# Altium project Transmitter.PrjPcb
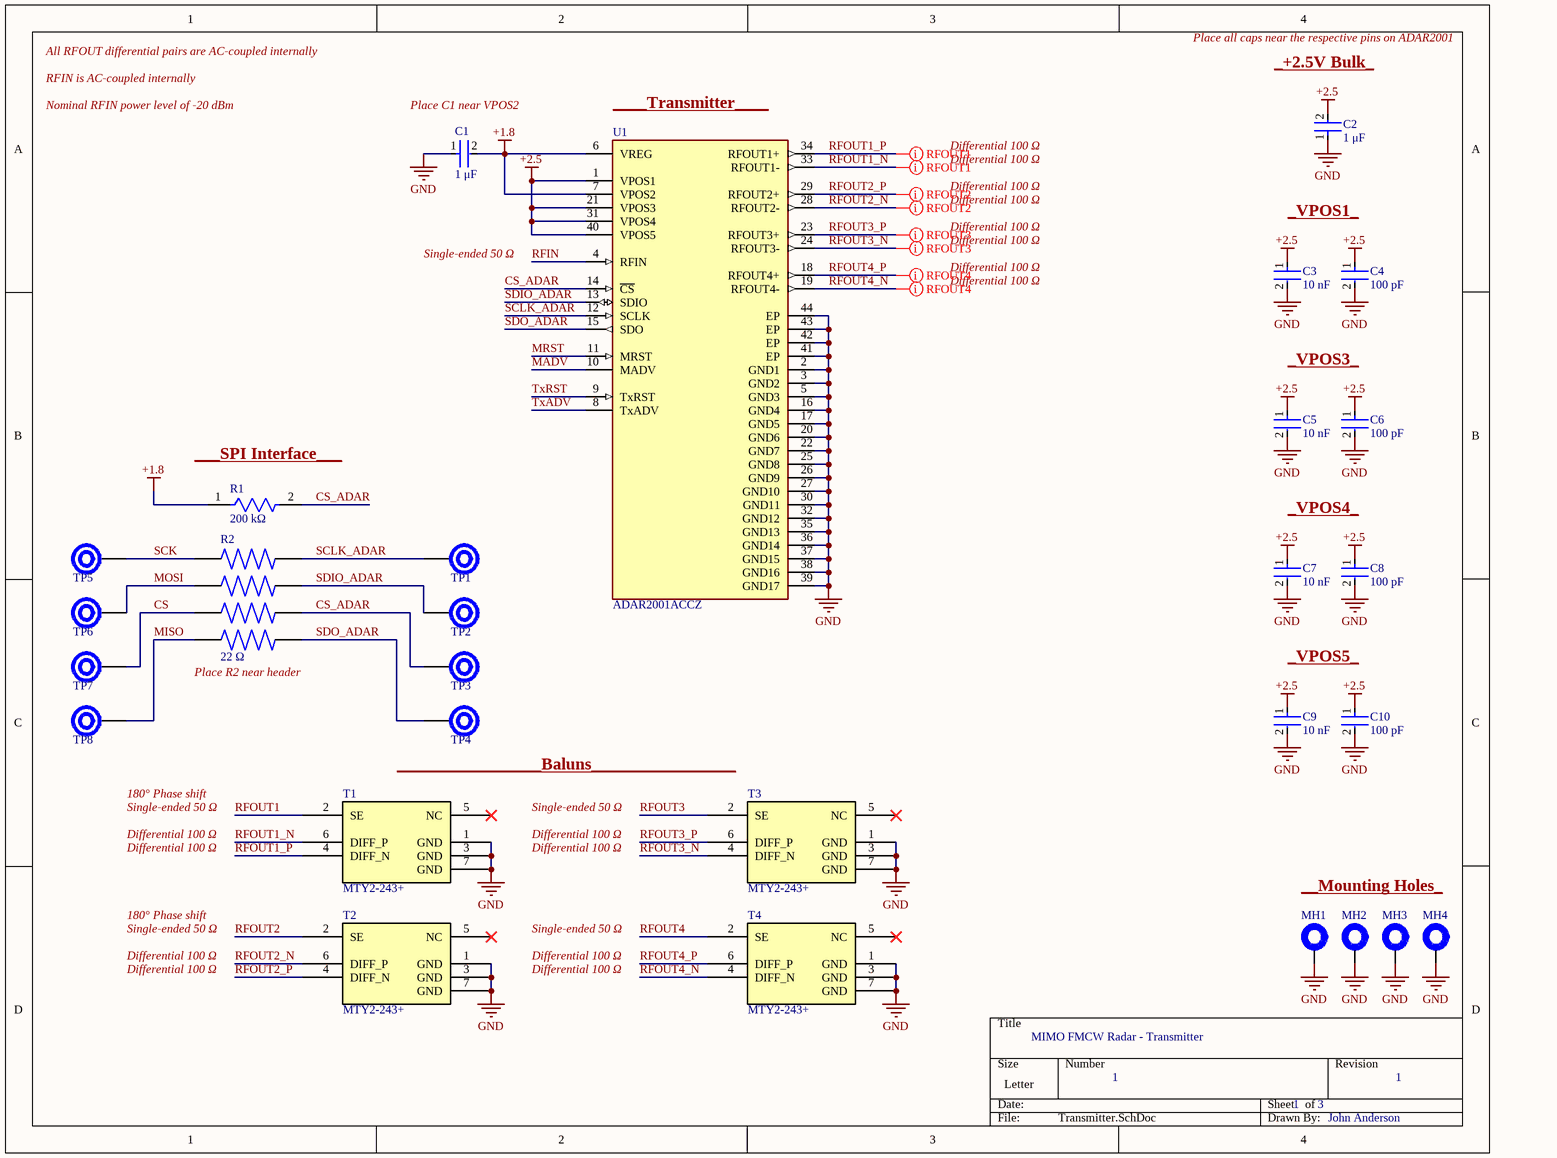
[diagram p0: Transmitter.SchDoc]
3 sheets, 75 parts. Net scope: global (net labels, ports and power ports of the same name join across sheets).
Board file: PCB.PcbDoc
Sheets:
  Transmitter.SchDoc
  Interface.SchDoc
  Power.SchDoc

## Sheet Transmitter.SchDoc
size Letter

### Parts
C1  1 μF  [FP-0603-L_1_6_0_15-W_0_8-MFG]
C2  1 μF  [FP-0603-L_1_6_0_15-W_0_8-MFG]
C3  10 nF  [CGA3E2X7R1H103K080AA-Footprint-1]
C4  100 pF  [FP-C0603C-CF-IPC_C]
C5  10 nF  [CGA3E2X7R1H103K080AA-Footprint-1]
C6  100 pF  [FP-C0603C-CF-IPC_C]
C7  10 nF  [CGA3E2X7R1H103K080AA-Footprint-1]
C8  100 pF  [FP-C0603C-CF-IPC_C]
C9  10 nF  [CGA3E2X7R1H103K080AA-Footprint-1]
C10  100 pF  [FP-C0603C-CF-IPC_C]
MH1  M3 Plated Mounting Hole - Loose  [M3 Plated Mounting Hole-Footprint-1]  (value not drawn)
MH2  M3 Plated Mounting Hole - Loose  [M3 Plated Mounting Hole-Footprint-1]  (value not drawn)
MH3  M3 Plated Mounting Hole - Loose  [M3 Plated Mounting Hole-Footprint-1]  (value not drawn)
MH4  M3 Plated Mounting Hole - Loose  [M3 Plated Mounting Hole-Footprint-1]  (value not drawn)
R1  200 kΩ  [FP-RG1608-IPC_C]
R2  22 Ω  [CAY16-22R0F4LF-Footprint-1]
T1  MTY2-243+  [MTY2-243+-Footprint-1]
T2  MTY2-243+  [MTY2-243+-Footprint-1]
T3  MTY2-243+  [MTY2-243+-Footprint-1]
T4  MTY2-243+  [MTY2-243+-Footprint-1]
TP1  Test Point - 32 mil  [Test Point - 32 mil-Footprint-1]  (value not drawn)
TP2  Test Point - 32 mil  [Test Point - 32 mil-Footprint-1]  (value not drawn)
TP3  Test Point - 32 mil  [Test Point - 32 mil-Footprint-1]  (value not drawn)
TP4  Test Point - 32 mil  [Test Point - 32 mil-Footprint-1]  (value not drawn)
TP5  Test Point - 32 mil  [Test Point - 32 mil-Footprint-1]  (value not drawn)
TP6  Test Point - 32 mil  [Test Point - 32 mil-Footprint-1]  (value not drawn)
TP7  Test Point - 32 mil  [Test Point - 32 mil-Footprint-1]  (value not drawn)
TP8  Test Point - 32 mil  [Test Point - 32 mil-Footprint-1]  (value not drawn)
U1  ADAR2001ACCZ  [FP-CC-40-7-MFG]

### Nets
+1.8: C1.2 R1.1 U1.6(VREG) U1.7(VPOS2)
+2.5: C2.2 C3.1 C4.1 C5.1 C6.1 C7.1 C8.1 C9.1 C10.1 U1.1(VPOS1) U1.21(VPOS3) U1.31(VPOS4) U1.40(VPOS5)
GND: C1.1 C2.1 C3.2 C4.2 C5.2 C6.2 C7.2 C8.2 C9.2 C10.2 MH1.1 MH2.1 MH3.1 MH4.1 T1.1(GND) T1.3(GND) T1.7(GND) T2.1(GND) T2.3(GND) T2.7(GND) T3.1(GND) T3.3(GND) T3.7(GND) T4.1(GND) T4.3(GND) T4.7(GND) U1.2(GND1) U1.3(GND2) U1.5(GND3) U1.16(GND4) U1.17(GND5) U1.20(GND6) U1.22(GND7) U1.25(GND8) U1.26(GND9) U1.27(GND10) U1.30(GND11) U1.32(GND12) U1.35(GND13) U1.36(GND14) U1.37(GND15) U1.38(GND16) U1.39(GND17) U1.41(EP) U1.42(EP) U1.43(EP) U1.44(EP)
CS: R2.3 TP7.1
CS_ADAR: R1.2 R2.6 TP3.1 U1.14(~{CS})
MADV: U1.10(MADV)
MISO: R2.4 TP8.1
MOSI: R2.2 TP6.1
MRST: U1.11(MRST)
RFIN: U1.4(RFIN)
RFOUT1: T1.2(SE)
RFOUT1_N: T1.6(DIFF_P) U1.33(RFOUT1-)
RFOUT1_P: T1.4(DIFF_N) U1.34(RFOUT1+)
RFOUT2: T2.2(SE)
RFOUT2_N: T2.6(DIFF_P) U1.28(RFOUT2-)
RFOUT2_P: T2.4(DIFF_N) U1.29(RFOUT2+)
RFOUT3: T3.2(SE)
RFOUT3_N: T3.4(DIFF_N) U1.24(RFOUT3-)
RFOUT3_P: T3.6(DIFF_P) U1.23(RFOUT3+)
RFOUT4: T4.2(SE)
RFOUT4_N: T4.4(DIFF_N) U1.19(RFOUT4-)
RFOUT4_P: T4.6(DIFF_P) U1.18(RFOUT4+)
SCK: R2.1 TP5.1
SCLK_ADAR: R2.8 TP1.1 U1.12(SCLK)
SDIO_ADAR: R2.7 TP2.1 U1.13(SDIO)
SDO_ADAR: R2.5 TP4.1 U1.15(SDO)
TxADV: U1.8(TxADV)
TxRST: U1.9(TxRST)

Not connected (* = marked no-connect by the designer): T1 5(NC)*; T2 5(NC)*; T3 5(NC)*; T4 5(NC)*

### Layout directives
differential pair: RFOUT1_N, RFOUT1_P, RFOUT2_N, RFOUT2_P, RFOUT3_N, RFOUT3_P, RFOUT4_N, RFOUT4_P

### Notes on the sheet
- All RFOUT differential pairs are AC-coupled internally
- RFIN is AC-coupled internally
- Place all caps near the respective pins on ADAR2001
- (near C2) _+2.5V Bulk_
- Nominal RFIN power level of -20 dBm
- (near C1) Place C1 near VPOS2
- (near U1) ____Transmitter____
- Differential 100 Ω
- _VPOS1_
- Single-ended 50 Ω
- _VPOS3_
- (near R1) ___SPI Interface___
- _VPOS4_
- (near R2) Place R2 near header
- _VPOS5_
- _________________Baluns_________________
- 180° Phase shift
- __Mounting Holes_
- MIMO FMCW Radar - Transmitter
- 1
- 3
- John Anderson

### Library data of the parts
C1 C2 = CMP-00100-1: Ceramic Capacitor, Multilayer, Ceramic, 50V, 10% +Tol, 10% -Tol, X7R, 15% TC, 1uF, Surface Mount, 0603; Multilayer: Yes; Packaging: Tape and Reel; Dielectric Material: Ceramic; Terminal Finish: Tin; Min Operating Temperature: -55°C; Mounting Technology: Surface Mount; Pins: 2; Rated DC Voltage (URdc): 50V; Tolerance (fill in as +-): 10%; Package Style: SMTMeter; Length: 1.6mm; RoHS Compliant: Yes; Temperature Characteristics Code: X7R; Value: 1uF; Tolerance  (fill in as +-): 10%; Max Operating Temperature: 125°C; JESD-609 Code: e3; Package Shape: Rectangular; Termination: Wraparound; Reach SVHC Compliant: Yes; Case/Package: 0603; Width: 0.8mm; Capacitor Type: Ceramic; Height: 0.8mm
C3 C5 C7 C9 = CMP-00157-1: CGA Series 0603 10 nF 50 V ±10 % Tolerance X7R SMT Multilayer Ceramic Capacitor; Manufacturer Lifecycle Status: PRODUCTION; Voltage Rating: 50V; Value: 10nF; Tolerance: 10%; Weight: 2.012816mg; Min Width: 700µm; Lead Free: Lead Free; Voltage Rating (DC): 50V; Max Length: 1.7mm; Width: 800µm; Schedule B: 8532240020, 8532240020; Thickness: 889µm; China RoHS: Compliant; Height: 800µm; Material: Ceramic; REACH SVHC: Yes; RoHS: Compliant; Dielectric: X7R; Length: 1.6mm; Ratings: AEC-Q200; Mounting Technology: Surface Mount; Composition: Ceramic; Case/Package: 0603; Termination: SMD/SMT; Dielectric Material: Ceramic; Lifecycle Status: Production; Min Operating Temperature: -55°C; Max Operating Temperature: 125°C; Number of Terminals: 2; Case Code (Metric): 1608; Case Code (Imperial): 0603; Max Width: 900µm; Min Length: 1.5mm
C4 C6 C8 C10 = CMP-00365-1: Multilayer Ceramic Capacitors MLCC – SMD/SMT; KEMET; C0603C101J5GACTU; 100 pF; 0603; 50 V; 50 V; Voltage: 50V; Tolerance: 5%; Dielectric: C0G; Temperature Coefficient: 30ppm/°C; Dissipation Factor: 0.1%; Value: 100pF; Contact Material: Tin; Schedule B: 8532240020, 8532240020; Termination: SMD/SMT; Packaging: Cut Tape; Country of Origin: Mainland China, Mexico; RoHS: Compliant; Height: 800µm; Voltage Rating (AC): 50V; Material: Ceramic; Lifecycle Status: Production; Number of Terminals: 2; Voltage Rating: 50V; Case/Package: 0603; Mounting Technology: Surface Mount; Length: 1.6mm; Min Operating Temperature: -55°C; Width: 800µm; Introduction Date: 1997-02-01; Lead Pitch: 700µm; China RoHS: Compliant; Depth: 800µm; Harmonized Tariff Schedule (HTS) Code: 8532.24.00.20; REACH SVHC: Yes; Dielectric Material: Ceramic; Lead Free: Lead Free; Case Code (Imperial): 0603; Radiation Hardening: No; Voltage Rating (DC): 50V; Export Control Classification Number (ECCN) Code: EAR99; Max Operating Temperature: 125°C; Thickness: 863.6µm; Pins: 2
MH1-MH4 = CMP-00204-1: Plated M3 mounting hole with loose tolerance. 3.6 mm hole diameter, 4.6 mm plated diameter.
R1 = CMP-00366-1: Res Thin Film 0603 200K Ohm 0.1% 0.1W(1/10W) ±25ppm/C Sulfur Resistant Pad SMD Automotive T/R; Voltage Rating (DC): 75V; Working Voltage: 100V; Temperature Coefficient: 25ppm/°C; Max Power Dissipation: 100mW; Value: 200kΩ; Number of Terminals: 2; Height: 400µm; Composition: Thin Film; RoHS: Compliant; Number of Terminations: 2; Lifecycle Status: Production; REACH SVHC: Yes; Termination: SMD/SMT; Tolerance: 0.1%; Weight: 2.012816mg; Case Code (Metric): 1608; Power Dissipation: 100mW; Max Operating Temperature: 155°C; Voltage Rating: 100V; Export Control Classification Number (ECCN) Code: EAR99; Min Operating Temperature: -55°C; Harmonized Tariff Schedule (HTS) Code: 8533.21.00.30; Mounting Technology: Surface Mount; Lead Free: Lead Free; Case Code (Imperial): 0603; Schedule B: 8533210045; Length: 1.6mm; Width: 800µm; Power Rating: 100mW; Introduction Date: 2006-03-30; Features: Automotive AEC-Q200; Case/Package: 0603; Country of Origin: Mainland China, Japan
R2 = CMP-00370-1: Res Thick Film Array 22 Ohm 1% 0.25W(1/4W) ±200ppm/C ISOL 8-Pin 1206(4 X 0603) Convex SMD T/R; Temperature Coefficient: 200ppm/°C; Power Per Element: 62.5mW; Number of Elements: 1; Power Dissipation: 250mW; Number of Resistors: 4; Voltage Rating (DC): 50V; Value: 22Ω; Circuit Type: Isolated; REACH SVHC: Yes; Depth: 1.6mm; Case/Package: 1206; Case Code (Imperial): 1206; Lead Pitch: 800µm; Width: 1.6mm; China RoHS: Non-Compliant; Pins: 8; Introduction Date: 2003-04-07; Case Code (Metric): 3216; Schedule B: 8533210025, 8533210025; Mounting Technology: Surface Mount; Termination: Convex; Export Control Classification Number (ECCN) Code: EAR99; Min Operating Temperature: -55°C; Military Standard: Not; Tolerance: 1%; Height: 500µm; Number of Circuits: 4; Lifecycle Status: Production; Working Voltage: 50V; RoHS: Compliant; Max Operating Temperature: 125°C; Contact Plating: Tin; Number of Terminals: 8; Length: 3.2mm; Terminal Pitch: 800µm
T1-T4 = CMP-00368-1: RF Transformer, 10000MHz Min, 24000MHz Max; Insertion Loss (dB): 2.2dB; Clock Frequency: 24GHz; Height: 1mm; Max Operating Temperature: 85°C; Mounting Technology: Surface Mount; Export Control Classification Number (ECCN) Code: EAR99; RoHS: Compliant; Width: 2mm; Length: 2mm; Lifecycle Status: Production; Min Operating Temperature: -40°C; Introduction Date: 2019-12-24
TP1-TP8 = CMP-00284-1: 32 mil (0.8 mm) test point.
U1 = CMP-00364-1: Active RF Multipliers x4 10GHz to 40GHz-OUT 40-Pin LGA EP Tray; Manufacturer Lifecycle Status: PRODUCTION; Bandwidth: 7.5GHz; Max Junction Temperature (Tj): 135°C; Clock Frequency: 40GHz; RoHS: Compliant; Lifecycle Status: Production; Height: 780µm; Pins: 40; Max Operating Temperature: 85°C; Min Operating Temperature: -40°C; Schedule B: 8542390000

## Sheet Interface.SchDoc
size Letter
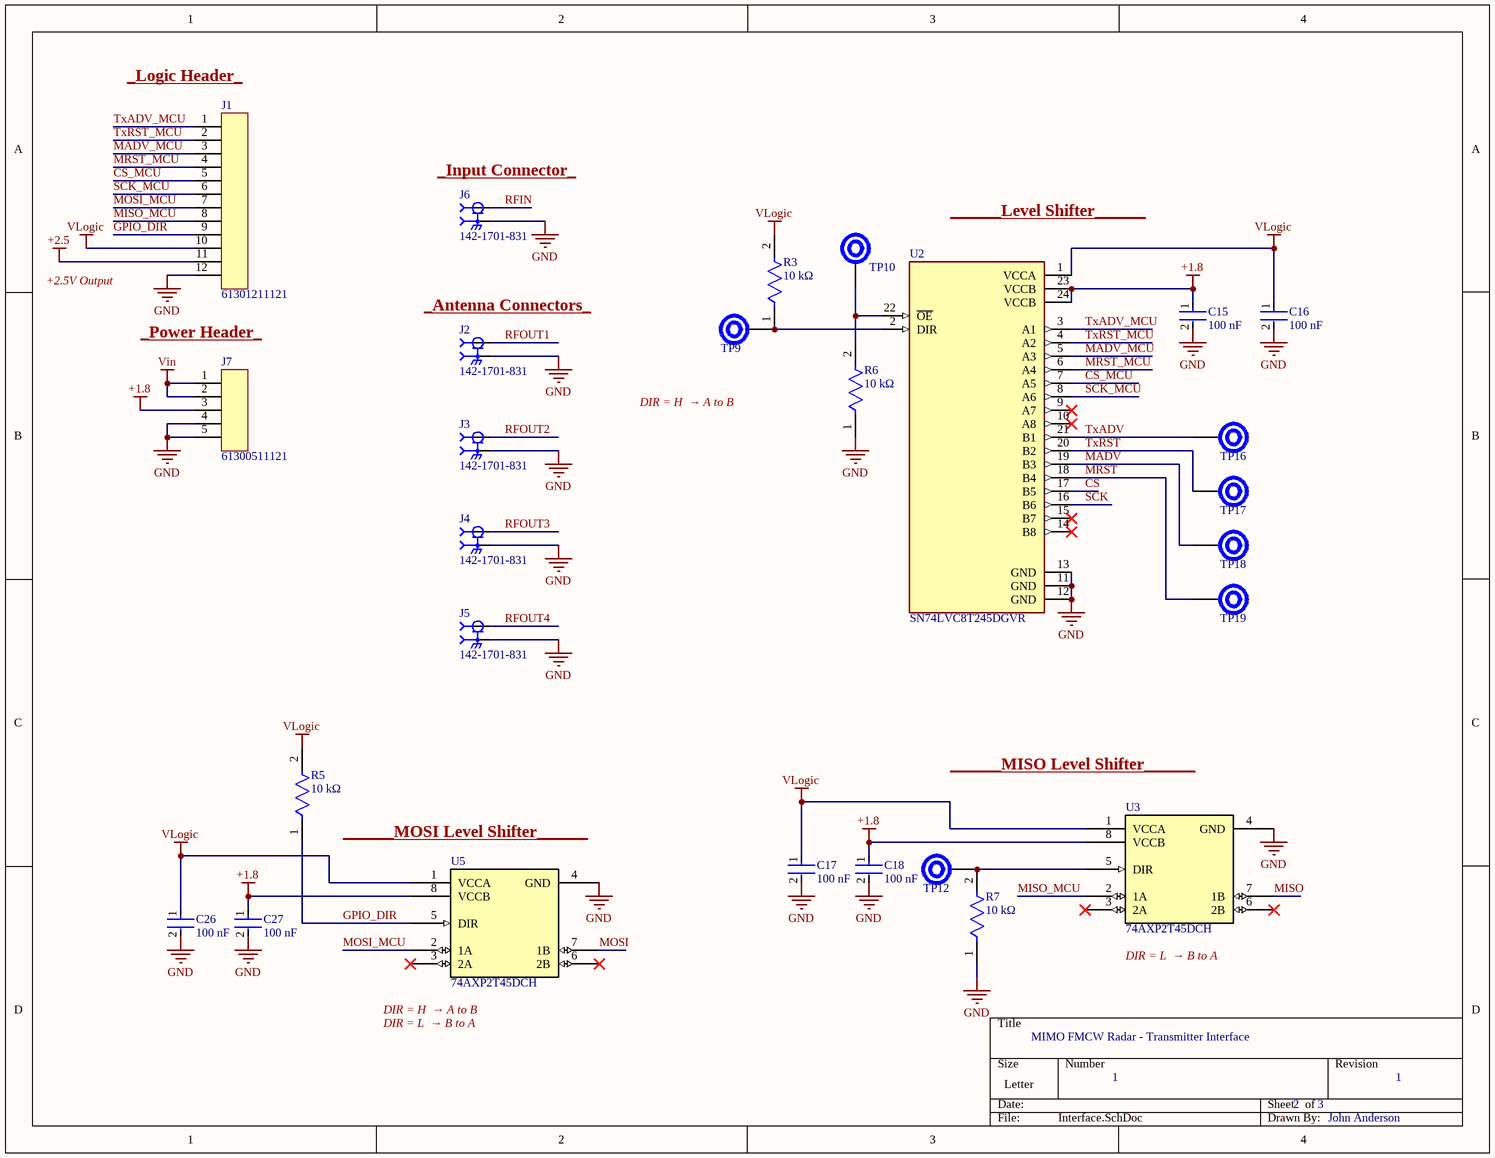
[diagram p1: Interface.SchDoc]

### Parts
C15  100 nF  [FP-CGA3E-0_3-0_1-MFG]
C16  100 nF  [FP-CGA3E-0_3-0_1-MFG]
C17  100 nF  [FP-CGA3E-0_3-0_1-MFG]
C18  100 nF  [FP-CGA3E-0_3-0_1-MFG]
C26  100 nF  [FP-CGA3E-0_3-0_1-MFG]
C27  100 nF  [FP-CGA3E-0_3-0_1-MFG]
J1  61301211121  [61301211121]
J2  142-1701-831  [142-1701-831-Footprint-1]
J3  142-1701-831  [142-1701-831-Footprint-1]
J4  142-1701-831  [142-1701-831-Footprint-1]
J5  142-1701-831  [142-1701-831-Footprint-1]
J6  142-1701-831  [142-1701-831-Footprint-1]
J7  61300511121  [61300511121]
R3  10 kΩ  [FP-RC0603-0_55-IPC_C]
R5  10 kΩ  [FP-RC0603-0_55-IPC_C]
R6  10 kΩ  [FP-RC0603-0_55-IPC_C]
R7  10 kΩ  [FP-RC0603-0_55-IPC_C]
TP9  Test Point - 32 mil  [Test Point - 32 mil-Footprint-1]  (value not drawn)
TP10  Test Point - 32 mil  [Test Point - 32 mil-Footprint-1]  (value not drawn)
TP12  Test Point - 32 mil  [Test Point - 32 mil-Footprint-1]  (value not drawn)
TP16  Test Point - 32 mil  [Test Point - 32 mil-Footprint-1]  (value not drawn)
TP17  Test Point - 32 mil  [Test Point - 32 mil-Footprint-1]  (value not drawn)
TP18  Test Point - 32 mil  [Test Point - 32 mil-Footprint-1]  (value not drawn)
TP19  Test Point - 32 mil  [Test Point - 32 mil-Footprint-1]  (value not drawn)
U2  SN74LVC8T245DGVR  [SN74LVC8T245DGVR-Footprint-1]
U3  74AXP2T45DCH  [74AXP2T45DCH-Footprint-1]
U5  74AXP2T45DCH  [74AXP2T45DCH-Footprint-1]

### Nets
+1.8: C15.1 C18.1 C27.1 J7.3 U2.23(VCCB) U2.24(VCCB) U3.8(VCCB) U5.8(VCCB)
+2.5: J1.11
GND: C15.2 C16.2 C17.2 C18.2 C26.2 C27.2 J1.12 J2.2(GND) J3.2(GND) J4.2(GND) J5.2(GND) J6.2(GND) J7.4 J7.5 R6.1 R7.1 U2.11(GND) U2.12(GND) U2.13(GND) U3.4(GND) U5.4(GND)
Vin: J7.1 J7.2
VLogic: C16.1 C17.1 C26.1 J1.10 R3.2 R5.2 U2.1(VCCA) U3.1(VCCA) U5.1(VCCA)
CS: U2.17(B5)
CS_MCU: J1.5 U2.7(A5)
GPIO_DIR: J1.9 R5.1 U5.5(DIR)
MADV: TP18.1 U2.19(B3)
MADV_MCU: J1.3 U2.5(A3)
MISO: U3.7(1B)
MISO_MCU: J1.8 U3.2(1A)
MOSI: U5.7(1B)
MOSI_MCU: J1.7 U5.2(1A)
MRST: TP19.1 U2.18(B4)
MRST_MCU: J1.4 U2.6(A4)
RFIN: J6.1(SIG)
RFOUT1: J2.1(SIG)
RFOUT2: J3.1(SIG)
RFOUT3: J4.1(SIG)
RFOUT4: J5.1(SIG)
SCK: U2.16(B6)
SCK_MCU: J1.6 U2.8(A6)
TxADV: TP16.1 U2.21(B1)
TxADV_MCU: J1.1 U2.3(A1)
TxRST: TP17.1 U2.20(B2)
TxRST_MCU: J1.2 U2.4(A2)
NetR3_1: R3.1 TP9.1 U2.2(DIR)
NetR6_2: R6.2 TP10.1 U2.22(~{OE})
NetR7_2: R7.2 TP12.1 U3.5(DIR)

Not connected (* = marked no-connect by the designer): U2 9(A7)* 10(A8)* 14(B8)* 15(B7)*; U3 3(2A)* 6(2B)*; U5 3(2A)* 6(2B)*

### Notes on the sheet
- (near J1) _Logic Header_
- (near J6) _Input Connector_
- ______Level Shifter______
- +2.5V Output
- _Power Header_
- (near J2) _Antenna Connectors_
- DIR = H  → A to B
- ______MISO Level Shifter______
- ______MOSI Level Shifter______
- (near U3) DIR = L  → B to A
- DIR = L  → B to A
- (near U5) DIR = H  → A to B
- MIMO FMCW Radar - Transmitter Interface
- 1
- 2
- 3
- John Anderson

### Library data of the parts
C15-C18 C26 C27 = CMP-00054-1: Ceramic Capacitor, Multilayer, Ceramic, 50V, 10% +Tol, 10% -Tol, X7R, 15% TC, 0.1uF, Surface Mount, 0603; Reference Standard: AEC-Q200; Value: 100nF; Multilayer: Yes; Min Operating Temperature: -55°C; Reach SVHC Compliant: Yes; Case/Package: 0603; Width: 0.8mm; Dielectric Material: Ceramic; Pins: 2; JESD-609 Code: e3; Package Style: SMTMeter; Capacitor Type: Ceramic; Mounting Technology: Surface Mount; Tolerance  (fill in as +-): 10%; Max Operating Temperature: 125°C; Packaging: Tape and Reel; Tolerance (fill in as +-): 10%; Terminal Finish: Nickel; Termination: Wraparound; Height: 0.8mm; Temperature Characteristics Code: X7R; Rated DC Voltage (URdc): 50V; Length: 1.6mm; Package Shape: Rectangular; RoHS Compliant: Yes
J1 = CMP-00202-1: THT Vertical Pin Header WR-PHD, Pitch 2.54 mm, Single Row, 12 pins; Number of Positions: 12; Current Rating: 3A; Connector Type: Male Pin; Pitch: 2.54mm; Contact Resistance: 20mΩ; Gender: Male; Operating Supply Voltage: 250V; Color: Black; Contact Plating: Gold; Packaging: Bulk; Mounting Technology: Through Hole; Contact Mating Length: 5.9944mm; Number of Rows: 1; Contact Material: Copper; Number of Contacts: 12; Lead Pitch: 2.54mm; Orientation: Vertical; Pins: 12; Termination: Solder; RoHS: Compliant
J2-J6 = CMP-00382-1: RF SMA Connector, 1 Contact(s), Female, Board Mount, Surface Mount Terminal, Locking, Jack; Polarity: Standard; Insertion Loss (dB): 0.55dB; Insulation Resistance: 1GΩ; Connector Type: SMA, Socket; Body Plating: Gold; Clock Frequency: 26.5GHz; Impedance: 50Ω; Voltage Rating: 170V; Body Material: Brass; Contact Resistance: 4mΩ; Number of Ports: 1; Gender: Male; Dielectric Material: PTFE; Min Operating Temperature: -65°C; Case/Package: SMA; Contact Gender: Female; Shell Material: Brass; RoHS: Compliant; Harmonized Tariff Schedule (HTS) Code: 8536.69.40.10; Introduction Date: 2010-04-24; Orientation: Straight; Lifecycle Status: Production; Contact Material: Copper; Max Operating Temperature: 165°C; Pins: 1; Fastening Type: Threaded; Termination: Solder; Mounting Technology: Edge; Contact Plating: Gold; Export Control Classification Number (ECCN) Code: EAR99; Frequency: 26.5GHz; Housing Color: Gold; REACH SVHC: Yes
J7 = CMP-00200-1: THT Vertical Pin Header WR-PHD, Pitch 2.54 mm, Single Row, 5 pins; Number of Positions: 5; Pitch: 2.54mm; Operating Supply Voltage: 250V; Current Rating: 3A; Contact Resistance: 20mΩ; Gender: Male; Connector Type: Male Pin; Lead Free: Lead Free; Min Operating Temperature: -40°C; Orientation: Vertical; Number of Contacts: 5; Contact Mating Length: 5.9944mm; Pins: 5; Max Operating Temperature: 105°C; Lead Pitch: 2.54mm; RoHS: Compliant; Height: 8.89mm; Voltage Rating: 250V; Mounting Technology: Through Hole; Termination: Solder; Number of Rows: 1; Contact Plating: Gold; Packaging: Bulk; Contact Material: Gold; Color: Black
R3 R5-R7 = CMP-00049-1: Fixed Resistor, Metal Glaze/thick Film, 0.1W, 10000ohm, 75V, 1% +/-Tol, 100ppm/Cel, Surface Mount, 0603; Package Width: 0.8mm; Rated Temperature: 70°C; Temperature Coefficient (ppm/Cel): 100; Package Height: 0.45mm; Power: 100mW; Value: 10kR; Additional Feature: LASER TRIMMABLE; Package Length: 1.6mm; Case/Package: 0603; Termination: Wraparound; Max Operating Temperature: 155°C; Construction: Chip; Mounting Technology: Surface Mount; Packaging: Tape and Reel; RoHS Compliant: Yes; Pins: 2; Working Voltage: 75V; Min Operating Temperature: -55°C; Package Shape: Rectangular; Resistor Type: FIXED RESISTOR; Technology: METAL GLAZE/THICK FILM; Terminal Finish: Nickel; Tolerance: 1%; JESD-609 Code: e3; Reach SVHC Compliant: Yes
TP9 TP10 TP12 TP16-TP19 = CMP-00284-1: 32 mil (0.8 mm) test point.
U2 = CMP-00379-1: IC BUS TRANSCVR 8BIT 24TVSOP / Voltage Level Translator 8-CH Bidirectional 24-Pin TVSOP T/R; Manufacturer Lifecycle Status: ACTIVE; Propagation Delay: 4.2ns; Number of Outputs: 8; Number of Circuits: 1; Topology: Push-Pull; Polarity: Non-Inverting; Data Rate: 500Mbps; Logic Function: Transceiver, Translator; Quiescent Current: 15µA; High Level Output Current: -32mA; Low Level Output Current: 32mA; Operating Supply Voltage: 3.3V; Min Supply Voltage: 1.65V; Turn-On Delay Time: 32.2ns; Max Supply Voltage: 5.5V; Weight: 60.894776mg; Lifecycle Status: Production; Radiation Hardening: No; Length: 5mm; Min Operating Temperature: -40°C; Contact Plating: Gold; Number of Bits: 8; Lead Free: Lead Free; Width: 4.4mm; Termination: SMD/SMT; Height: 1.2mm; Case/Package: TFSOP; Number of Channels: 8; Number of Inputs: 8; Number of Elements: 1; Schedule B: 8542390000; REACH SVHC: No; RoHS: Compliant; Direction: Bidirectional; Packaging: Cut Tape; Number of Transceivers: 8; Pins: 24; Max Operating Temperature: 85°C; Mounting Technology: Surface Mount; Thickness: 1.05mm
U3 U5 = CMP-00336-1: Dual Supply Level Translator 2-bit Bidirectional 0.95V to 5.5V 8-Pin VSSOP; Manufacturer Lifecycle Status: RELEASED FOR SUPPLY; Propagation Delay: 16.5ns; Number of Ports: 2; Operating Supply Voltage: 1.2V; Clock Edge Trigger Type: Positive Edge; Number of Circuits: 1; Low Level Output Current: 12mA; Max Supply Current: 13µA; Load Capacitance: 5pF; Min Supply Voltage: 900mV; Min Operating Temperature: -40°C; Number of Terminals: 8; Number of Bits: 2; Width: 2mm; RoHS: Compliant; Terminal Pitch: 500µm; Introduction Date: 2024-07-25; Number of Channels: 1; Lifecycle Status: Production; China RoHS: Compliant; Max Operating Temperature: 125°C; Max Supply Voltage: 5.5V; Length: 2.3mm; Direction: Bidirectional; Height - Seated (Max): 1mm; Harmonized Tariff Schedule (HTS) Code: 8542.39.00.60; REACH SVHC: Yes

## Sheet Power.SchDoc
size Letter
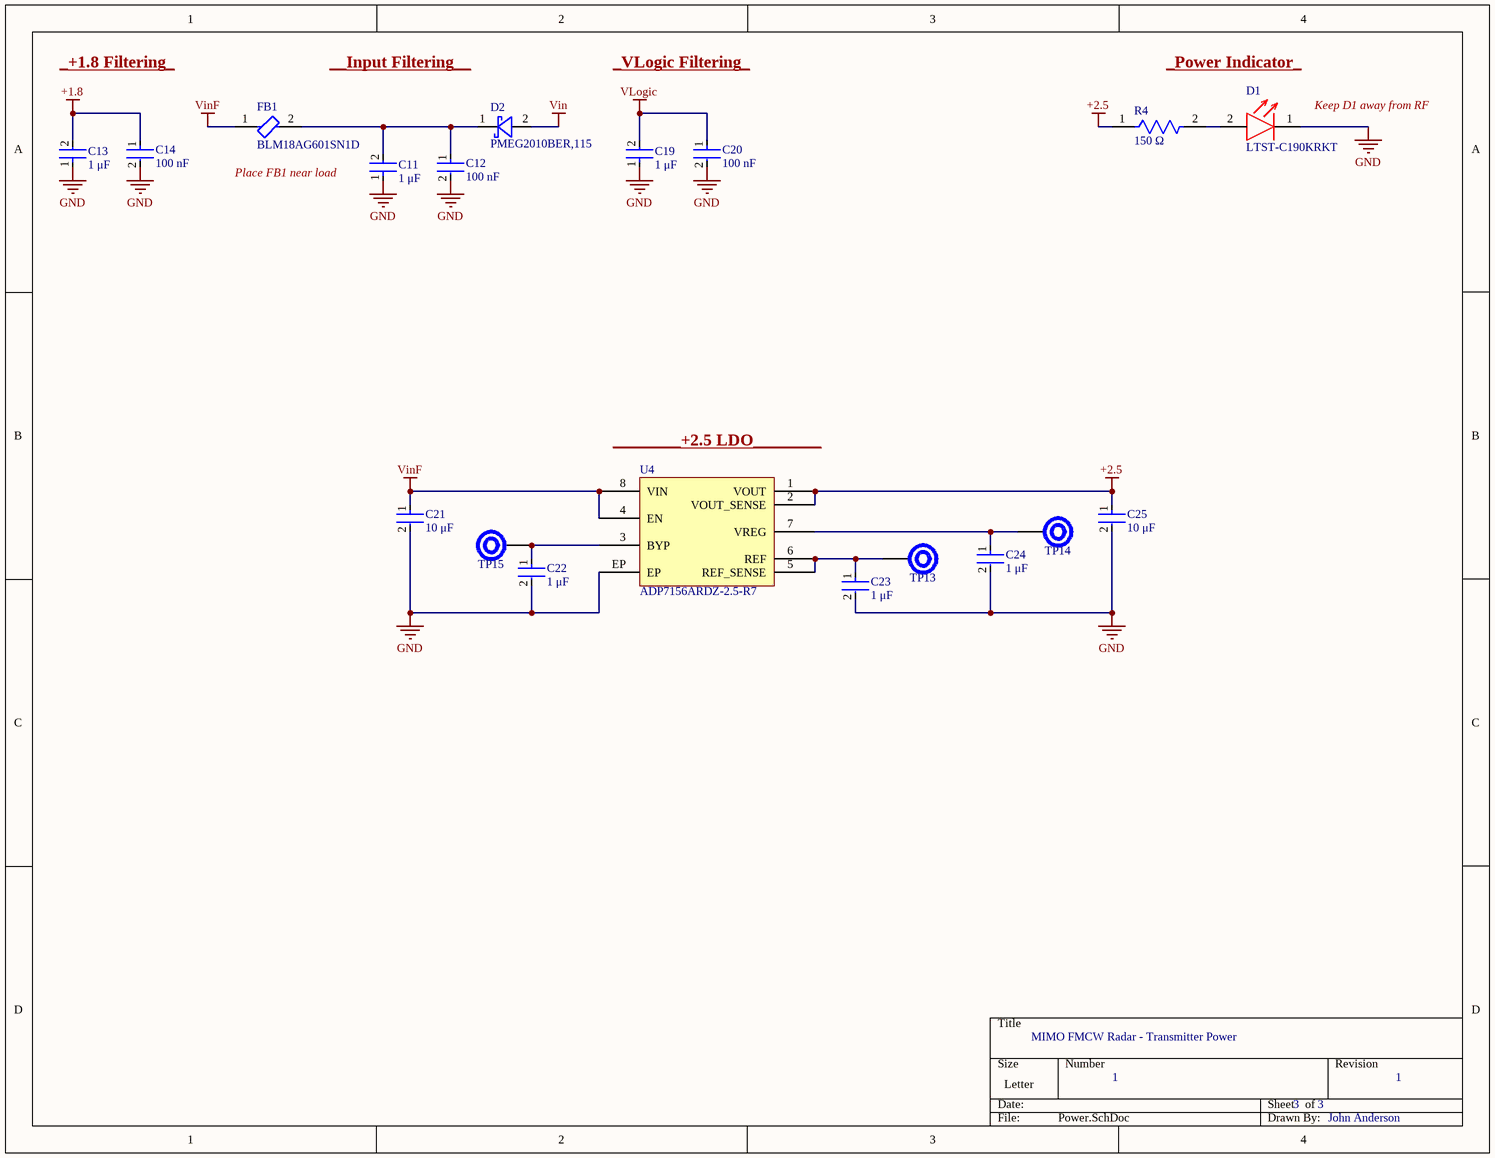
[diagram p2: Power.SchDoc]

### Parts
C11  1 μF  [FP-0603-L_1_6_0_15-W_0_8-MFG]
C12  100 nF  [FP-CGA3E-0_3-0_1-MFG]
C13  1 μF  [FP-0603-L_1_6_0_15-W_0_8-MFG]
C14  100 nF  [FP-CGA3E-0_3-0_1-MFG]
C19  1 μF  [FP-0603-L_1_6_0_15-W_0_8-MFG]
C20  100 nF  [FP-CGA3E-0_3-0_1-MFG]
C21  10 μF  [FP-GRM21B-0_15-IPC_C]
C22  1 μF  [FP-0603-L_1_6_0_15-W_0_8-MFG]
C23  1 μF  [FP-0603-L_1_6_0_15-W_0_8-MFG]
C24  1 μF  [FP-0603-L_1_6_0_15-W_0_8-MFG]
C25  10 μF  [FP-GRM21B-0_15-IPC_C]
D1  LTST-C190KRKT  [LTST-C190KRKT-Footprint-1]
D2  PMEG2010BER,115  [PMEG2010BER,115-Footprint-1]
FB1  BLM18AG601SN1D  [FP-BLM18-0_15-t0_8-IPC_B]
R4  150 Ω  [FP-RMCF0603-IPC_C]
TP13  Test Point - 32 mil  [Test Point - 32 mil-Footprint-1]  (value not drawn)
TP14  Test Point - 32 mil  [Test Point - 32 mil-Footprint-1]  (value not drawn)
TP15  Test Point - 32 mil  [Test Point - 32 mil-Footprint-1]  (value not drawn)
U4  ADP7156ARDZ-2.5-R7  [ADP7156ARDZ-2.5-R7-Footprint-1]

### Nets
+1.8: C13.2 C14.1
+2.5: C25.1 R4.1 U4.1(VOUT) U4.2(VOUT_SENSE)
GND: C11.1 C12.2 C13.1 C14.2 C19.1 C20.2 C21.2 C22.2 C23.2 C24.2 C25.2 D1.1 U4.EP
Vin: D2.2
VinF: C21.1 FB1.1 U4.4(EN) U4.8(VIN)
VLogic: C19.2 C20.1
NetC11_2: C11.2 C12.1 D2.1 FB1.2
NetC22_1: C22.1 TP15.1 U4.3(BYP)
NetC23_1: C23.1 TP13.1 U4.5(REF_SENSE) U4.6(REF)
NetC24_1: C24.1 TP14.1 U4.7(VREG)
NetD1_2: D1.2 R4.2

### Notes on the sheet
- _+1.8 Filtering_
- __Input Filtering__
- _VLogic Filtering_
- _Power Indicator_
- (near D1) Keep D1 away from RF
- Place FB1 near load
- (near U4) ________+2.5 LDO________
- MIMO FMCW Radar - Transmitter Power
- 1
- 3
- John Anderson

### Library data of the parts
C11 C13 C19 C22-C24 = CMP-00100-1: as C1 on sheet Transmitter; Packaging: Tape and Reel; Dielectric Material: Ceramic; Terminal Finish: Tin; Min Operating Temperature: -55°C; Mounting Technology: Surface Mount; Pins: 2; Rated DC Voltage (URdc): 50V; Tolerance (fill in as +-): 10%; Package Style: SMTMeter; Length: 1.6mm; RoHS Compliant: Yes; Temperature Characteristics Code: X7R; Value: 1uF; Tolerance  (fill in as +-): 10%; Max Operating Temperature: 125°C; JESD-609 Code: e3; Package Shape: Rectangular; Termination: Wraparound; Reach SVHC Compliant: Yes; Case/Package: 0603; Width: 0.8mm; Capacitor Type: Ceramic; Height: 0.8mm
C12 C14 C20 = CMP-00054-1: as C15 on sheet Interface; Min Operating Temperature: -55°C; Reach SVHC Compliant: Yes; Case/Package: 0603; Width: 0.8mm; Dielectric Material: Ceramic; Pins: 2; JESD-609 Code: e3; Package Style: SMTMeter; Capacitor Type: Ceramic; Mounting Technology: Surface Mount; Tolerance  (fill in as +-): 10%; Max Operating Temperature: 125°C; Packaging: Tape and Reel; Tolerance (fill in as +-): 10%; Terminal Finish: Nickel; Termination: Wraparound; Height: 0.8mm; Temperature Characteristics Code: X7R; Rated DC Voltage (URdc): 50V; Length: 1.6mm; Package Shape: Rectangular; RoHS Compliant: Yes
C21 C25 = CMP-00053-1: Ceramic Capacitor, Multilayer, Ceramic, 25V, 20% +Tol, 20% -Tol, X5R, 15% TC, 10uF, Surface Mount, 0805; Multilayer: Yes; Rated DC Voltage (URdc): 25V; Package Style: SMTMeter; Terminal Finish: Nickel; RoHS Compliant: Yes; Package Shape: Rectangular; Reach SVHC Compliant: Yes; Pins: 2; Capacitor Type: Ceramic; Height: 1.25mm; Temperature Characteristics Code: X5R; Packaging: Tape and Reel; Min Operating Temperature: -55°C; JESD-609 Code: e3; Tolerance  (fill in as +-): 20%; Case/Package: 0805; Mounting Technology: Surface Mount; Length: 2mm; Max Operating Temperature: 85°C; Width: 1.25mm; Dielectric Material: Ceramic; Termination: Wraparound; Tolerance (fill in as +-): 20%; Value: 10uF
D1 = CMP-00109-2: Red, Single Color LED, Red, Water Clear; Luminous Intensity-Nom: 54mcd; Channels: 1; Shape: Rectangular; Forward Current: 30mA; Forward Voltage: 2.4V; Luminous Intensity-Min: 130cd; Overall Height: 0.8mm; Viewing Angle: 130°; Reverse Voltage-Max: 5V; Color@wavelength: Red; RoHS Compliant: Yes; Lens Style: WATER CLEAR; Size: 1.1mm; Max Operating Temperature: 85°C; Reach SVHC Compliant: Yes; Packaging: Tape and Reel; Optoelectronic Device Type: SINGLE COLOR LED; Color: Red; Pins: 2; Terminal Pitch: 1.5mm; Mounting Technology: Surface Mount; Min Operating Temperature: -30°C
D2 = CMP-00387-1: PMEG2010 Series 20 V 1 A SMT Low VF MEGA Schottky Barrier Rectifier - SOD-123W; Manufacturer Lifecycle Status: RELEASED FOR SUPPLY; Average Rectified Current: 1A; Max Repetitive Reverse Voltage (Vrrm): 20V; Number of Elements: 1; Max Forward Surge Current (Ifsm): 50A; Max Power Dissipation: 1.8W; Forward Voltage: 340mV; Max Reverse Leakage Current: 50µA; Element Configuration: Single; Contact Plating: Tin; REACH SVHC: No; Schedule B: 8541100050; Radiation Hardening: No; Max Output current: 1A; Mounting Technology: Surface Mount; Lead Free: Lead Free; RoHS: Compliant; Number of Terminals: 2; Introduction Date: 2009-04-22; Country of Origin: Mainland China; Max Reverse Voltage (DC): 20V; Pins: 2; Max Operating Temperature: 150°C; Max Surge Current: 50A; Forward Current: 1A; Harmonized Tariff Schedule (HTS) Code: 8541.10.00.80; Peak Non-Repetitive Surge Current: 50A; Export Control Classification Number (ECCN) Code: EAR99; Reverse Standoff Voltage: 20V; Peak Reverse Current: 50µA; Min Operating Temperature: -55°C; Lifecycle Status: Production
FB1 = CMP-00321-1: Ferrite Beads Multi-Layer 600Ohm 25% 100MHz 500mA 380mOhm DCR 0603 Automotive Paper T/R; DC Resistance (DCR): 380mΩ; Material: Ferrite, Steel; Number of Circuits: 1; Value: 380mΩ; Impedance: 600Ω; Shielding: Unshielded; Core Material: Ferrite; Radiation Hardening: No; Width: 800µm; Height: 800µm; Max Operating Temperature: 125°C; Packaging: Cut Tape; Max DC Current: 500mA; Depth: 800µm; RoHS: Compliant; Country of Origin: Japan, Thailand; Number of Terminals: 2; Termination: SMD/SMT; REACH SVHC: Yes; Pins: 2; Weight: 2.012816mg; Case/Package: 0603; Test Frequency: 100MHz; Introduction Date: 2001-08-28; DC Current: 500mA; Lifecycle Status: Production; Case Code (Metric): 1608; Military Standard: Not; Frequency: 100MHz; Tolerance: 25%; Schedule B: 8543706000, 8543706000; Current Rating: 500mA; Max Current Rating: 500mA; Export Control Classification Number (ECCN) Code: EAR99; Harmonized Tariff Schedule (HTS) Code: 8504.50.80.00; ESR: 380mΩ; Clock Frequency: 100MHz; RMS Current (Irms): 500mA; Min Operating Temperature: -55°C; Length: 1.6mm; Lead Free: Lead Free; Number of Lines: 1; Case Code (Imperial): 0603
R4 = CMP-00177-1: 150 Ohm, Res Thick Film 0603 1% 0.1W ±100ppm/°C Molded SMD Paper T/R; Working Voltage: 75V; Power Rating: 100mW; Value: 150Ω; Case Code (Metric): 1608; Mounting Technology: Surface Mount; China RoHS: Non-Compliant; Number of Terminals: 2; Min Operating Temperature: -55°C; Lifecycle Status: Production; Temperature Coefficient: 100ppm/°C; Case Code (Imperial): 0603; Length: 1.5494mm; Packaging: Cut Tape (CT); Case/Package: 0603; Features: Automotive AEC-Q200; Schedule B: 8533210045, 8533210045; Max Power Dissipation: 100mW; Composition: Thick Film; Max Operating Temperature: 155°C; RoHS: Compliant; Width: 800µm; Tolerance: 1%; Voltage Rating: 75V; REACH SVHC: Yes; Lead Free: Lead Free; Power Dissipation: 100mW; Height: 450µm; Number of Terminations: 2; Contact Plating: Tin; Radiation Hardening: No
TP13-TP15 = CMP-00284-1: 32 mil (0.8 mm) test point.
U4 = CMP-00386-1: LDO Regulator Pos 2.5V 1.2A 8-Pin SOIC N EP T/R; Manufacturer Lifecycle Status: PRODUCTION; Min Current Limit: 1.4A; Polarity: Positive; Min Supply Voltage: 3V; Quiescent Current: 8mA; Number of Regulators: 1; Dropout Voltage: 120mV; Accuracy: 0.6%; Max Supply Voltage: 5.5V; Min Input Voltage: 2.3V; Output Type: Fixed; Max Junction Temperature (Tj): 125°C; REACH SVHC: No; Packaging: Cut Tape; Case/Package: SOIC; Lead Free: Contains Lead; Height: 1.75mm; Output Current: 1.2A; Nominal Output Voltage: 2.5V; Output Voltage: 2.5V; Lifecycle Status: Production; Min Operating Temperature: -40°C; Max Output current: 1.2A; Contact Plating: Tin; Number of Outputs: 1; RoHS: Compliant; Pins: 8; Schedule B: 8542390000, 8542390000; Mounting Technology: Surface Mount; Max Operating Temperature: 125°C

## Nets that join several sheets
+1.8: Transmitter (C1.2 R1.1 U1.6 U1.7), Interface (8 pins), Power (C13.2 C14.1)
+2.5: Transmitter (13 pins), Interface (J1.11), Power (C25.1 R4.1 U4.1 U4.2)
GND: Transmitter (47 pins), Interface (21 pins), Power (13 pins)
Vin: Interface (J7.1 J7.2), Power (D2.2)
VLogic: Interface (9 pins), Power (C19.2 C20.1)
CS: Transmitter (R2.3 TP7.1), Interface (U2.17)
MADV: Transmitter (U1.10), Interface (TP18.1 U2.19)
MISO: Transmitter (R2.4 TP8.1), Interface (U3.7)
MOSI: Transmitter (R2.2 TP6.1), Interface (U5.7)
MRST: Transmitter (U1.11), Interface (TP19.1 U2.18)
RFIN: Transmitter (U1.4), Interface (J6.1)
RFOUT1: Transmitter (T1.2), Interface (J2.1)
RFOUT2: Transmitter (T2.2), Interface (J3.1)
RFOUT3: Transmitter (T3.2), Interface (J4.1)
RFOUT4: Transmitter (T4.2), Interface (J5.1)
SCK: Transmitter (R2.1 TP5.1), Interface (U2.16)
TxADV: Transmitter (U1.8), Interface (TP16.1 U2.21)
TxRST: Transmitter (U1.9), Interface (TP17.1 U2.20)